# EAGLE design ScoutMakes_FM_StemmaQT (EAGLE 9.6.2)
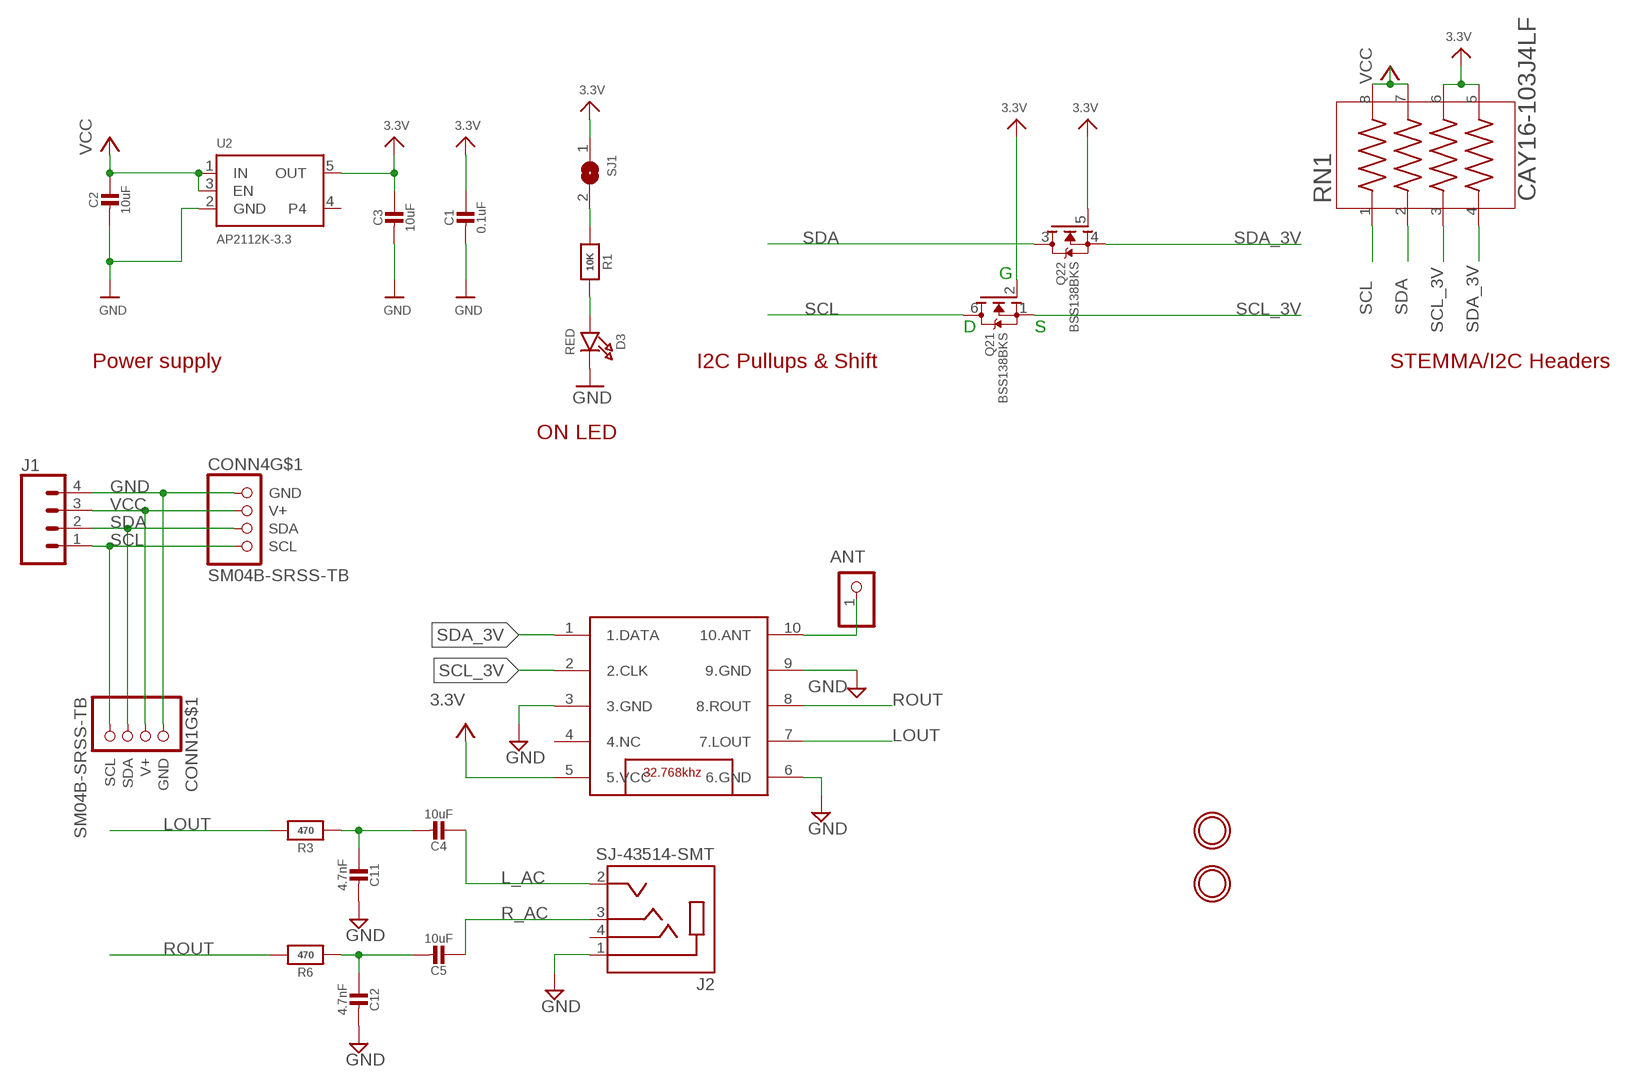
[diagram p0: schematic, sheet 1]

## Parts
ANT  PINHD-1X1  [1X01]
C1  0.1uF  CAP_CERAMIC0603_NO  [0603-NO]
C2  10uF  CAP_CERAMIC0805-NOOUTLINE  [0805-NO]
C3  10uF  CAP_CERAMIC0805-NOOUTLINE  [0805-NO]
C4  10uF  CAP_CERAMIC0805-NOOUTLINE  [0805-NO]
C5  10uF  CAP_CERAMIC0805-NOOUTLINE  [0805-NO]
C11  4.7nF  CAP_CERAMIC0805-NOOUTLINE  [0805-NO]
C12  4.7nF  CAP_CERAMIC0805-NOOUTLINE  [0805-NO]
CONN1  SM04B-SRSS-TB  STEMMA_I2C_QT  [JST_SH4]
CONN4  SM04B-SRSS-TB  STEMMA_I2C_QT  [JST_SH4]
D3  RED  LED0805_NOOUTLINE  [CHIPLED_0805_NOOUTLINE]
J1  CONN_04  [1X04]
J2  SJ-43514-SMT  [CUI_SJ-43514-SMT]
Q2  BSS138BKS  MOSFET-N_DUAL  [SOT363]
R1  10K  RESISTOR_0603_NOOUT  [0603-NO]
R3  470  RESISTOR0805_NOOUTLINE  [0805-NO]
R6  470  RESISTOR0805_NOOUTLINE  [0805-NO]
RN1  CAY16-103J4LF  [RESCAF80P320X160X60-8N]
SJ1  SOLDERJUMPER  [SOLDERJUMPER_ARROW_NOPASTE]
U1  TEA5767  [TJ-102BC]
U2  AP2112K-3.3  VREG_SOT23-5  [SOT23-5]
U$1  MOUNTINGHOLE2.5  [MOUNTINGHOLE_2.5_PLATED]
U$17  MOUNTINGHOLE2.5  [MOUNTINGHOLE_2.5_PLATED]

## Nets
3.3V: C1.1 C3.1 Q2.2(1:G) Q2.5(2:G) RN1.5 RN1.6 SJ1.1 U1.5(5.VCC) U2.5(OUT)
ANT: ANT.1 U1.10(10.ANT)
GND: C1.2 C2.2 C3.2 C11.2 C12.2 CONN1.1(GND) CONN4.1(GND) D3.C J1.4 J2.1(SLEEVE) U1.3(3.GND) U1.6(6.GND) U1.9(9.GND) U2.2(GND)
L_AC: C4.1 J2.2(TIP)
LOUT: R3.1 U1.7(7.LOUT)
N$1: D3.A R1.2
N$2: C5.2 C12.1 R6.2
N$3: R1.1 SJ1.2
N$6: C4.2 C11.1 R3.2
R_AC: C5.1 J2.3(RING1)
ROUT: R6.1 U1.8(8.ROUT)
SCL: CONN1.4(SCL) CONN4.4(SCL) J1.1 Q2.6(1:D) RN1.1
SCL_3V: Q2.1(1:S) RN1.3 U1.2(2.CLK)
SDA: CONN1.3(SDA) CONN4.3(SDA) J1.2 Q2.3(2:D) RN1.2
SDA_3V: Q2.4(2:S) RN1.4 U1.1(1.DATA)
VCC [highpower]: C2.1 CONN1.2(V+) CONN4.2(V+) J1.3 RN1.7 RN1.8 U2.1(IN) U2.3(EN)
Unconnected: CONN1.MT1(MT) CONN1.MT2(MT) CONN4.MT1(MT) CONN4.MT2(MT) J2.4(RING2) U1.4(4.NC) U2.4

## Notes on the sheet
- G
- D | S
- Power supply | I2C Pullups & Shift | STEMMA/I2C Headers
- ON LED

## Library data of the parts
ANT = adafruit:PINHD-1X1: Pin header 1x1 for 0.1" spacing With round pins
C1-C5 C11 C12 = microbuilder:CAP_CERAMIC: Ceramic Capacitors For new designs, use the packages preceded by an '_' character since they are more reliable: The following footprints should be used on most boards: _0402 - Standard footprint for regular board layouts _0603 - Standard footprint for regular board layouts _0805 - Standard footprint for regular board layouts _1206 - Standard footprint for regular board layouts For extremely tight-pitch boards where space is at a premium, the following 'micro-pitch' footprints can be used (smaller pads, no silkscreen outline, etc.): _0402MP - Micro-pitch footprint for very dense/compact boards _0603MP - Micro-pitch footprint for very dense/compact boards _0805MP - Micro-pitch footprint for very dense/compact boards _1206MP - Micro-pitch footprint for very dense/compact boards
CONN1 CONN4 = microbuilder:STEMMA_I2C
D3 = microbuilder:LED: LED 0603 - 0603 Surface Mount Package 2mA: Green LED - Low Power (3.9mcd, 2ma, 1.7Vf) - Digikey: 475-2709-2-ND Orange LED - Low Power (9.8mcd, 2ma, 1.8Vf) - Digikey: 475-1194-2-ND Red LED - Low Power (5mcd, 2ma, 1.8Vf) - Digikey: 475-1195-2-ND Yellow LED - Low Power (7mcd, 2ma, 1.8Vf) - Digikey: 475-1196-2-ND 5mA: Blue LED - Low Power (17mcd, 5ma, 2.9Vf) - Digikey: LNJ937W8CRACT-ND 0805 - 0805 Surface Mount Package 2mA: Red LED (8.8mcd, 2mA, 1.8Vf, Clear) - Low Power [Digikey: 475-2510-1-ND] Green LED (5mcd, 2mA, 1.8Vf, Clear) - Low Power [Digikey: 475-2730-1-ND] Yellow LED (11.3mcd, 2mA, 1.8Vf, Clear) - Low Power [Digikey: 475-2555-1-ND] 20mA: Red LED (104mcd, 20mA, Diffused) - LS R976 [Digikey: 475-1278-6-ND] Red LED (12mcd, 20mA, 2.0Vf, Clear) - APT2012EC [Digikey: 754-1128-1-ND] Green LED (15mcd, 20mA, 2.2Vf, Clear) - APT2012GC [Digikey: 754-1131-1-ND] Orange LED (160mcd, 20mA, 2.1Vf, Clear) - APT2012SECK [Digikey: 754-1130-1-ND] 1206 - 1206 Surface Mount Package Green LED (26mcd, 20mA, Diffused) - LG N971 [Digikey: 475-1407-6-ND] Red LED (15mcd, 20mA, Diffused) - LH N974 [Digikey: 475-1416-6-ND] Cree - Cree High-Power Surface Mount LEDs XPEBWT-L1-0000-00D50 - White 111lm 350mA 2.9Vf 6200K 110° XTEAWT-00-0000-00000LEE3 - White 114lm 350mA 2.85Vf 5000K 115° Everlight - Everlight 45-21 Series Surface Mount LEDs 45-21/QK2C-B2832AC2CB2/2T - Warm White 2000mcd 20mA 3.25Vf 3050K 120° 45-21/LK2C-B38452C4CB2/2T - Nuetral White 2000mcd 20mA 3.25Vf 4150K 120° 45-21/LK2C-B50634C6CB2/2T - Cold White 2200mcd 20mA 3.25Vf 5650K 120° PLCC2 Reverse Mount LS T77K-J1L2-1-0-2-R18-Z - Red 11.25mcd 2mA 1.8Vf 630nm 120° LO T77K-L1M2-24-Z - Orange 19.6mcd 2mA 1.8Vf 606nm 120° LY T77K-K2M1-26-Z - Yellow 15.7mcd 2mA 1.8Vf 587nm 120°
J1 = SparkFun-Connectors:CONN_04: Multi connection point. Often used as Generic Header-pin footprint for 0.1 inch spaced/style header connections On any of the 0.1 inch spaced packages, you can populate with these: Break Away Headers - Straight <https://www.sparkfun.com/products/116> (PRT-00116) Break Away Male Headers - Right Angle <https://www.sparkfun.com/products/553> (PRT-00553) Female Headers <https://www.sparkfun.com/products/115> (PRT-00115) Break Away Headers - Machine Pin <https://www.sparkfun.com/products/117> (PRT-00117) Break Away Female Headers - Swiss Machine Pin <https://www.sparkfun.com/products/743> (PRT-00743) For SCREWTERMINALS and SPRING TERMINALS visit here: Screw Terimnals on SparkFun.com <https://www.sparkfun.com/search/results?term=Screw+Terminals> (5mm/3.5mm/2.54mm spacing) This device is also useful as a general connection point to wire up your design to another part of your project. Our various solder wires solder well into these plated through hole pads. Hook-Up Wire - Assortment (Stranded, 22 AWG) <https://www.sparkfun.com/products/11375> (PRT-11375) Hook-Up Wire - Assortment (Solid Core, 22 AWG) <https://www.sparkfun.com/products/11367> (PRT-11367) View the entire wire category on our website here <https://www.sparkfun.com/categories/141> Special notes: Molex polarized connector foot print use with SKU : PRT-08231 with associated crimp pins and housings. 1MM SMD Version SKU: PRT-10208; PROD_ID: CONN-09696
J2 = SJ-43514-SMT:SJ-43514-SMT: 4 conductor 3.5 mm Surface Mount Audio Jack; CUI_PURCHASE_URL: https://www.cuidevices.com/product/interconnect/connectors/audio-connectors/jacks/sj-4351x-smt-series?utm_source=snapeda.com&utm_medium=referral&utm_campaign=snapedaBOM; DESCRIPTION: 3.5 mm, 4 Conductors, Right Angle, Surface Mount (SMT), Audio Jack Connector; DIGI-KEY_PART_NUMBER: CP-43514SJCT-ND; MF: CUI Devices; MP: SJ-43514-SMT-TR; PACKAGE: None; PURCHASE-URL: https://pricing.snapeda.com/search/part/SJ-43514-SMT-TR/?ref=eda
Q2 = microbuilder:MOSFET-N_DUAL: Dual N-Channel MOSFET SOT363 (2.0x1.25mm) 2N7002PS - 60V, 320mA [Digikey: 568-5984-1-ND]
R1 R3 R6 = microbuilder:RESISTOR: Resistors For new designs, use the packages preceded by an '_' character since they are more reliable: The following footprints should be used on most boards: _0402 - Standard footprint for regular board layouts _0603 - Standard footprint for regular board layouts _0805 - Standard footprint for regular board layouts _1206 - Standard footprint for regular board layouts For extremely tight-pitch boards where space is at a premium, the following 'micro-pitch' footprints can be used (smaller pads, no silkscreen outline, etc.): _0402MP - Micro-pitch footprint for very dense/compact boards _0603MP - Micro-pitch footprint for very dense/compact boards _0805MP - Micro-pitch footprint for very dense/compact boards _1206MP - Micro-pitch footprint for very dense/compact boards
RN1 = CAY16-103J4LF:CAY16-103J4LF: Res Thick Film Array 75 Ohm 5% 0.25W(1/4W) ?200ppm/C ISOL Molded 8-Pin 1206(4 X 0603) Convex SMD T/R; DESCRIPTION: 10k Ohm ±5% 62.5mW Power Per Element Isolated Resistor Network/Array ±200ppm/°C 1206 (3216 Metric), Convex, Long Side Terminals; DIGI-KEY_PART_NUMBER: CAY16-103J4LFCT-ND; MF: Bourns; MP: CAY16-103J4LF; PACKAGE: 1206 Bourns; PURCHASE-URL: https://pricing.snapeda.com/search/part/CAY16-103J4LF/?ref=eda
SJ1 = microbuilder:SOLDERJUMPER: SMD Solder JUMPER Solder the two pads together to create a connection, or remove the solder to break it. REFLOW - Use this footprint for solder paste and reflow ovens. WAVE - Use this footprint for hand-soldering (larger pads). CLOSED - Has a trace between the two pads to ensure it is closed by default. The trace needs to be cut to disable the jumper, and can be closed again by creating a solder bridge between the two pads.; BOM: EXCLUDE
U1 = TEA5767:TEA5767
U2 = microbuilder:VREG_SOT23-5: SOT23-5 Fixed Voltage Regulators Part Current Out V Out V In V Dropout θJA (°C/W) TJ (°C) Digikey Part No. ADP121 150mA 3.3V 3.4-5.5V 0.09V @ 150mA -- -- ADP121-AUJZ33R7CT-ND ADP121 150mA 3.0V 3.1-5.5V 0.09V @ 150mA -- -- ADP121-AUJZ30R7CT-ND ADP122 300mA 3.3V 3.4-5.5V 0.085V @ 300mA -- -- ADP122AUJZ-3.3-R7CT-ND ADP1712 300mA 3.3V 3.5-5.5V 0.17V @ 300mA -- -- ADP1712AUJZ-3.3-R7TR-ND AP7311 (Low Cost) 150mA 3.3V 3.5-6V 0.15V @ 150mA -- -- AP7311-33WG-7DICT-ND LD39015M18R 150mA 1.8V 1.9V-5.5V 0.08V @ 100mA -- -- 497-6977-1-ND LP2985A-33DBVR 150mA 3.3V 3.3-16V 0.28V @ 150mA 206 150 296-18479-1-ND MCP1824T-3302E/OT 300mA 3.3V 3.5V-6V 0.2V @ 300mA -- -- MCP1824T-3302E/OTCT-ND MIC5205-2.5YM5 TR 150mA 2.5V 2.7-16V 0.165V @ 150mA -- -- 576-1257-2-ND MIC5205-3.0YM5 TR 150mA 3.0V 3.2V-16V 0.165V @ 150mA -- -- 576-1258-2-ND MIC5205-3.3YM5 TR 150mA 3.3V 3.5V-16V 0.165V @ 150mA -- -- 576-1259-2-ND TPS780330220 150mA 3.3V+2.2V 3.6-5.5V 250mV Max -- -- 296-23332-1-ND TDA3663/N1,135 100mA 3.3V 3.5-45V 0.18V @ 50mA -- -- 568-5343-1-ND Max operating temp can be calculated using θJA, TJ (max junction temperature), and power in watts. Set the "Maximum Ambient Temperature" until it reaches TJ ("Max Junction Temperature"), which is the absolute limit for safe use of the regulator: Heat Sink Temperature Calculator <http://www.daycounter.com/Calculators/Heat-Sink-Temperature-Calculator.phtml> For example, With 12V source into a 3.3V LP2985 and a 30mA load, we are dissipating (12V-3.3V) * 0.03A = 0.261W. With a θJA of 206 °C/W, a TJ of 150°C, and 261mW we can safely use the chip without a heat sink up to 75°C (=147.1°C Junction Temperature).
U$1 U$17 = microbuilder:MOUNTINGHOLE: Mounting Hole For #2 screws (0.086"/2.18mm width, 0.094"/2.4mm hole) use 2.5mm; BOM: EXCLUDE

## Net classes
1 highpower: width 0.406 mm, drill 0.483 mm
2 lowpower: width 0.305 mm, drill 0.483 mm

## Board
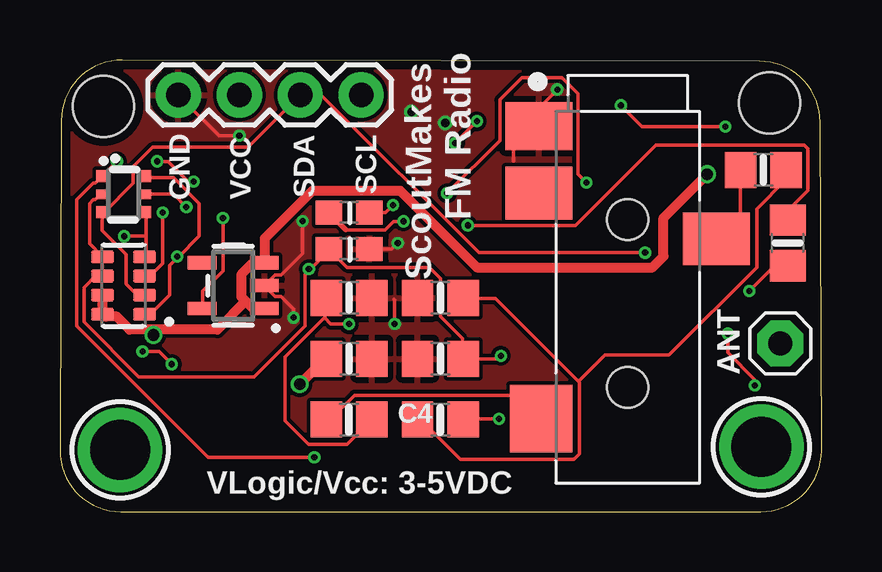
[diagram p1: board, top side]
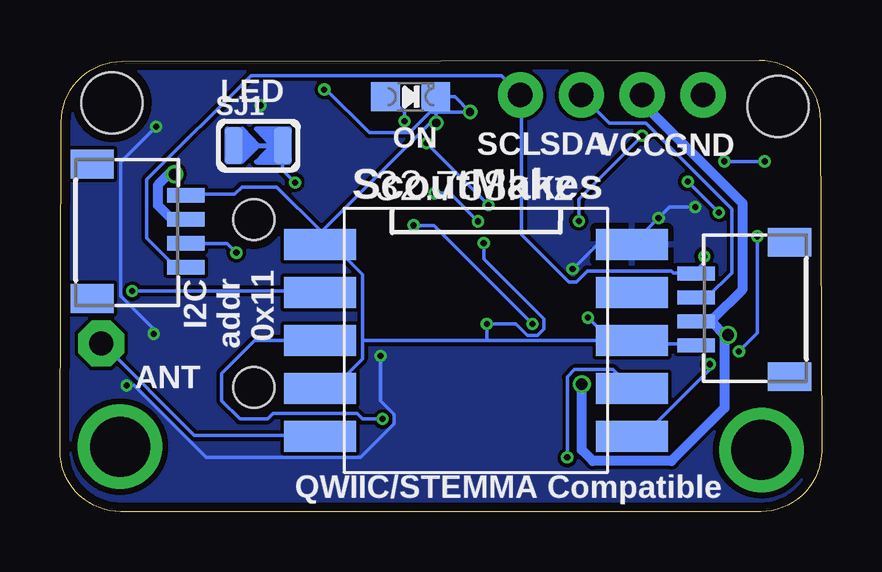
[diagram p2: board, bottom side, seen from below]

Size 31.75 x 18.84 mm. Coordinates in mm from the lower left corner, seen from the top.
Outline: 0.05,16.3 0,2.54 arc90 2.54,0 29.21,0 arc90 31.75,2.54 31.7,16.25 arc90 29.16,18.79 2.59,18.84 arc90 0.05,16.3
Copper layers (1*16): Top 0.035559375mm / dielectric 1.6mm / Bottom 0.035559375mm
Design rules "oshpark-2layer *": minimum track width 6mil, minimum drill 10mil, track to track 6mil, track to pad 6mil, pad to pad 6mil, via to via 6mil, smd to smd 6mil, copper to edge 15mil, drill to drill 6mil, minimum pad ring 5mil, minimum via ring 5mil, stop-mask expansion 2.5mil, vias tented up to drill 20mil, thermal gap 10mil
Holes 2.54 mm at 29.58,17.05 1.81,16.91

### Footprints (pad centres in the part's own frame; a part is rotated, then mirrored left to right if it is on the bottom)
1X01 = drill 1.016 pad 1.93 octagon: 1 0,0
0603-NO = smd 1.1 x 1: 1 -0.85,0; 2 0.85,0
0805-NO = smd 1.3 x 1.5: 1 -0.95,0; 2 0.95,0
JST_SH4 = smd 0.6 x 1.55: 1 -1.5,2.514; 2 -0.5,2.514; 3 0.5,2.514; 4 1.5,2.514 | smd 1.2 x 1.8: MT1 -2.8,-1.386; MT2 2.8,-1.386
CHIPLED_0805_NOOUTLINE = smd 1.2 x 1.2: A 0,-1.05; C 0,1.05
1X04 = drill 1.016 pad 1.88: 1 0,0; 2 2.54,0; 3 5.08,0; 4 7.62,0
CUI_SJ-43514-SMT = smd 2 x 2.8: 1 -7.15,-3.7 | smd 2.8 x 2.6: 2 5.05,-3.6 | smd 2.2 x 2.8: 3 -2.45,3.7; 4 -4.35,-3.7 | hole 1.7: -3.25,0; 3.75,0
SOT363 = smd 0.5 x 0.5: 1 -0.75,-0.9; 3 0.75,-0.9; 4 0.75,0.9; 6 -0.75,0.9 | smd 0.4 x 0.5: 2 0,-0.9; 5 0,0.9
RESCAF80P320X160X60-8N = smd 0.97 x 0.53: 1 -0.875,1.2; 2 -0.875,0.4; 3 -0.875,-0.4; 4 -0.875,-1.2; 5 0.875,-1.2; 6 0.875,-0.4; 7 0.875,0.4; 8 0.875,1.2
SOLDERJUMPER_ARROW_NOPASTE = smd 0.762 x 1.524: 1 -1.016,0; 2 1.016,0
TJ-102BC = smd 3 x 1.3: 1 -2,0.5; 2 -2,-1.5; 3 -2,-3.5; 4 -2,-5.5; 5 -2,-7.5; 6 11,-7.5; 7 11,-5.5; 8 11,-3.5; 9 11,-1.5; 10 11,0.5
SOT23-5 = smd 0.55 x 1.2: 1 -0.95,-1.3; 2 0,-1.3; 3 0.95,-1.3; 4 0.95,1.3; 5 -0.95,1.3
MOUNTINGHOLE_2.5_PLATED = drill 2.5 pad 3.2: P$1 0,0

### Placement (x,y rotation side)
ANT  30.03,7.02 0 top
C1  12.05,10.95 0 top
C2  12.05,6.38 0 top
C3  15.86,6.38 180 top
C4  12.05,3.84 0 top
C5  29.32,14.25 0 top
C11  12.05,8.92 0 top
C12  15.86,8.92 180 top
CONN1  29.02,11.69 270 bottom
CONN4  2.72,8.43 90 bottom
D3  17.13,17.3 270 bottom
J1  12.56,17.38 180 top
J2  23.67,8.93 270 top
Q2  2.65,13.24 270 top
R1  12.05,12.48 0 top
R3  30.34,11.21 90 top
R6  15.86,3.84 180 top
RN1  2.65,9.43 180 top
SJ1  23.48,15.27 0 bottom
U1  9.91,3.65 180 bottom
U2  7.22,9.43 90 top
U$1  29.25,2.71 0 top
U$17  2.51,2.57 0 top

### Tracks (layer width: path | path; a pad name or v marks a point on that pad's centre or on a via)
3.3V  (via drill 0.25)
  Top 0.152: Q2.5 4.74,13.24 v5.27,12.7 | v6.79,12.25 6.79,10.04 5.95,9.2 5.95,8.51 U2.5 | Q2.2 1.69,13.24 1.46,13.01 1.38,13.01 1.23,12.86 1.23,11.18 1.76,10.65 RN1.5 1.76,10.57 1.76,9.88 RN1.6 1.69,9.88 1.53,9.88 1,9.35 1,7.9 3.29,5.62 8.1,5.62 10.22,7.74 10.22,9.88 10.41,10.08 | 10.41,10.08 11.21,10.88 C1.1 11.21,10.95 11.97,10.19 15.4,10.19 15.86,9.73 15.86,8.13 16.77,7.22 16.77,6.38 C3.1 18.26,6.38 v18.38,6.49 | v10.37,10.11 10.41,10.08 | v28.97,5.26 28.97,5.5 27.85,6.63 v27.85,7.42 | v27.74,16.05 24.27,16.05 v23.38,16.94
  Bottom 0.152: v5.27,12.7 6.34,12.7 v6.79,12.25 7.86,11.18 U1.5 7.94,11.1 9.38,11.1 v10.37,10.11 | v28.97,5.26 28.66,5.26 25.67,2.27 19.21,2.27 17.82,3.67 17.82,4.06 18.38,4.63 v18.38,6.49 | v27.85,7.42 27.85,7.62 29.22,9 29.22,14.57 v27.74,16.05
  pour Bottom: 2.57,-0.02 arc-90 0.03,2.52 0.03,16.05 arc-90 2.66,18.68 28.89,18.68 arc-90 31.75,15.82 31.75,2.66 arc-90 29.07,-0.02 2.55,-0.02
ANT
  Bottom 0.152: U1.10 20.97,3.18 26.15,3.18 29.96,6.99 ANT.1
GND  (via drill 0.25, 0.35)
  Top 0.152: v13.96,7.83 13.96,8.82 13.93,8.84 | J1.4 6.64,15.68 v7.48,15.68 | v10.12,12.12 10.12,10.77 9.22,9.87 8.97,9.87 U2.2 8.97,8.98 9.22,8.98 9.74,8.46 v9.74,8.09 | v20.73,17.61 18.91,15.78 18.91,14.61 | C1.2 13.83,10.95 v14.08,11.21
  Bottom 0.152: CONN4.1 5.27,6.99 7.71,6.99 7.86,7.14 U1.3 7.94,7.14 8.79,7.14 | U1.6 20.89,11.18 20.89,11.64 16.31,16.22 v16.07,16.22 v16.08,16.22 D3.C 15.29,17.3 v14.66,16.67 16.32,16.67 17.18,15.8 18.85,15.8 20.66,17.61 v20.73,17.61 | CONN1.1 26.45,13.24 24.47,13.24 24.17,13.54 22.72,13.54 20.89,11.71 U1.6 | 19.14,7.14 19.14,9.88 20.43,11.18 20.81,11.18 U1.6 | 19.14,7.14 19.14,6.38 20.36,5.16 20.89,5.16 U1.9 | 19.14,7.14 13.96,7.14 | 13.96,7.14 8.79,7.14 | 13.96,7.14 v13.96,7.83 12.73,7.83 12.25,7.34 11.85,7.34 11.57,7.63 11.57,8.03 14.08,10.54 v14.08,11.21 | v7.48,15.68 10.12,13.04 v10.12,12.12 | v9.74,8.09 8.79,7.14
  pour Top: 2.54,0.05 arc-90 0.02,2.57 0.02,15.98 arc-90 2.77,18.74 28.7,18.74 arc-90 31.66,15.78 31.66,2.7 arc-90 28.99,0.02 22.88,0.02 arc90 22.86,0.05 2.53,0.05
L_AC
  Top 0.152: C4.1 11.14,3.86 11.29,3.86 12.28,4.86 19.14,4.86 20.05,3.94 J2.2
LOUT  (via drill 0.25)
  Top 0.152: v28.74,9.2 29.73,10.19 30.34,10.19 R3.1
  Bottom 0.152: v28.74,9.2 20.97,9.2 U1.7
N$1  (via drill 0.25)
  Top 0.152: R1.2 13.57,12.48 v13.88,12.78 | v17.38,16.29 v16.47,15.37
  Bottom 0.152: v16.47,15.37 v13.88,12.78 | v17.38,16.29 17.38,16.66 18.03,17.3 D3.A
N$2
  Top 0.152: 21.61,5.43 18.15,8.89 16.85,8.89 C12.1 | 21.61,5.43 21.65,5.39 21.65,2.42 21.42,2.19 16.7,2.19 15.1,3.79 14.95,3.79 R6.2 | 21.61,5.43 22.72,6.53 25.39,6.53 29.04,10.19 29.04,12.63 30.26,13.85 30.26,14.23 C5.2
N$3  (via drill 0.25)
  Top 0.152: v21.95,13.73 21.6,14.08 21.6,17.42 20.93,18.09 19.25,18.09 18.34,17.18 18.34,15.48 v16.14,13.28 | v14.32,12.11 13.91,12.11 13.55,11.75 11.92,11.75 | 11.2,12.47 R1.1
  Top 0.203: 11.92,11.75 11.2,12.47
  Bottom 0.152: SJ1.2 22.46,14.24 v21.95,13.73 | v16.14,13.28 15.49,13.28 v14.32,12.11
N$4
  Bottom 0.203: 23.43,15.26 23.1,15.26
N$6  (via drill 0.25)
  Top 0.152: 11.02,8.09 9.38,6.46 9.38,3.79 10.37,2.8 11.97,2.8 12.96,3.79 C4.2 | 11.02,8.09 11.06,8.13 11.06,8.89 C11.1 | R3.2 30.34,12.55 31.18,13.39 31.18,15.14 31.02,15.29 24.85,15.29 21.5,11.94 v17,11.94 | v12.05,7.83 11.29,7.83 11.02,8.09
  Bottom 0.152: v17,11.94 16.17,11.94 v12.05,7.83
R_AC
  Top 0.152: C5.1 28.36,14.23 28.36,12.32 27.44,11.41 J2.3
ROUT  (via drill 0.25)
  Top 0.152: v18.3,3.86 16.85,3.86 R6.1
  Bottom 0.152: v18.3,3.86 19.14,3.86 19.37,4.09 22.87,4.09 23.1,3.86 24.24,3.86 25,4.63 25,5.77 23.63,7.14 20.97,7.14 U1.8
SCL  (via drill 0.25)
  Top 0.152: 4.93,10.61 4.58,10.27 4.58,9.05 3.82,8.28 3.59,8.28 RN1.1 | 4.93,10.61 5.8,11.48 5.8,12.86 4.74,13.92 3.59,13.92 Q2.6 | v4.89,10.65 4.93,10.61
  Bottom 0.152: CONN1.4 26.53,10.27 26.99,10.27 28.13,11.41 28.13,13.85 23.79,18.19 13.35,18.19 12.58,17.43 J1.1 12.51,17.35 12.51,11.56 10.53,9.58 10.22,9.58 9.76,10.04 6.26,10.04 6.18,9.96 5.27,9.96 CONN4.4 5.27,10.04 4.89,10.42 v4.89,10.65
SCL_3V  (via drill 0.25)
  Top 0.152: v10.6,2.26 6.18,2.26 0.7,7.75 0.7,13.01 1.38,13.69 1.46,13.69 1.69,13.92 Q2.1 1.76,14 v2.37,14.61 | v4.28,12.48 4.28,10.34 3.82,9.88 3.59,9.88 RN1.3 | v5.57,13.77 5.34,13.77 4.51,14.61 v4.05,14.61
  Bottom 0.152: v10.6,2.26 10.6,5.62 10.3,5.92 8.7,5.92 7.94,5.16 U1.2 | v5.57,13.77 v4.28,12.48 | v2.37,14.61 v4.05,14.61
SDA  (via drill 0.25)
  Top 0.152: RN1.2 3.52,9.05 3.21,9.05 2.75,9.5 2.75,10.72 1.76,11.71 1.76,12.48 Q2.3 1.84,12.48 3.06,13.69 3.06,14.38 3.87,15.19 7.83,15.19 9.99,17.35 J1.2 10.07,17.35 10.91,17.35 17.46,10.8 v24.39,10.8
  Bottom 0.152: CONN4.3 5.19,8.97 4.74,8.97 3.74,9.96 3.74,12.63 7.33,16.21 8.85,16.21 9.99,17.35 J1.2 | v24.39,10.8 24.78,11.18 26.45,11.18 CONN1.3
SDA_3V  (via drill 0.25)
  Top 0.152: 3.59,11.48 3.59,10.65 RN1.4 | 3.59,11.48 3.59,12.48 Q2.4 | v2.68,11.48 3.59,11.48 | v3.44,6.68 4.13,6.68 v4.66,6.15
  Bottom 0.152: v2.68,11.48 2.68,7.45 v3.44,6.68 | v4.66,6.15 4.66,5.92 7.4,3.18 7.86,3.18 U1.1
VCC  (via drill 0.48)
  Top 0.406: v9.99,5.31 11.06,6.38 C2.1 | RN1.7 1.76,8.97 1.76,8.28 RN1.8 1.92,8.13 2.37,8.13 2.91,7.6 3.9,7.6 | 7.75,8.78 7.55,8.97 7.55,9.88 8.01,10.34 8.47,10.34 U2.3 8.55,10.57 8.55,11.41 10.53,13.39 14.18,13.39 17.38,10.19 24.7,10.19 25.16,10.65 25.16,12.25 v26.99,14.08 | 7.75,8.78 8.01,8.51 8.47,8.51 U2.1 | 3.9,7.6 6.56,7.6 7.75,8.78 | v3.9,7.37 3.9,7.6
  Bottom 0.406: v9.99,5.31 9.99,2.57 9.54,2.11 6.26,2.11 4.05,4.32 4.05,7.37 | 4.05,7.37 4.58,7.9 5.19,7.9 CONN4.2 4.51,8.06 3.29,9.28 3.29,12.86 7.4,16.97 7.4,17.35 J1.3 | v26.99,14.08 27.21,14.08 27.67,13.62 27.67,12.78 27.14,12.25 26.53,12.25 CONN1.2 | v3.9,7.37 4.05,7.37

### Text on the board
_tplace: ScoutMakes / FM Radio | GND | VCC | SDA | SCL | ANT | VLogic/Vcc: 3-5VDC
_bplace: LED | GND | VCC | SDA | SCL | ON | ScoutMakes | I2C / addr / 0x11 | ANT | QWIIC/STEMMA Compatible